# Altium schematic sheet 2014.10.05_Remote_V14.3.SchDoc
size A3
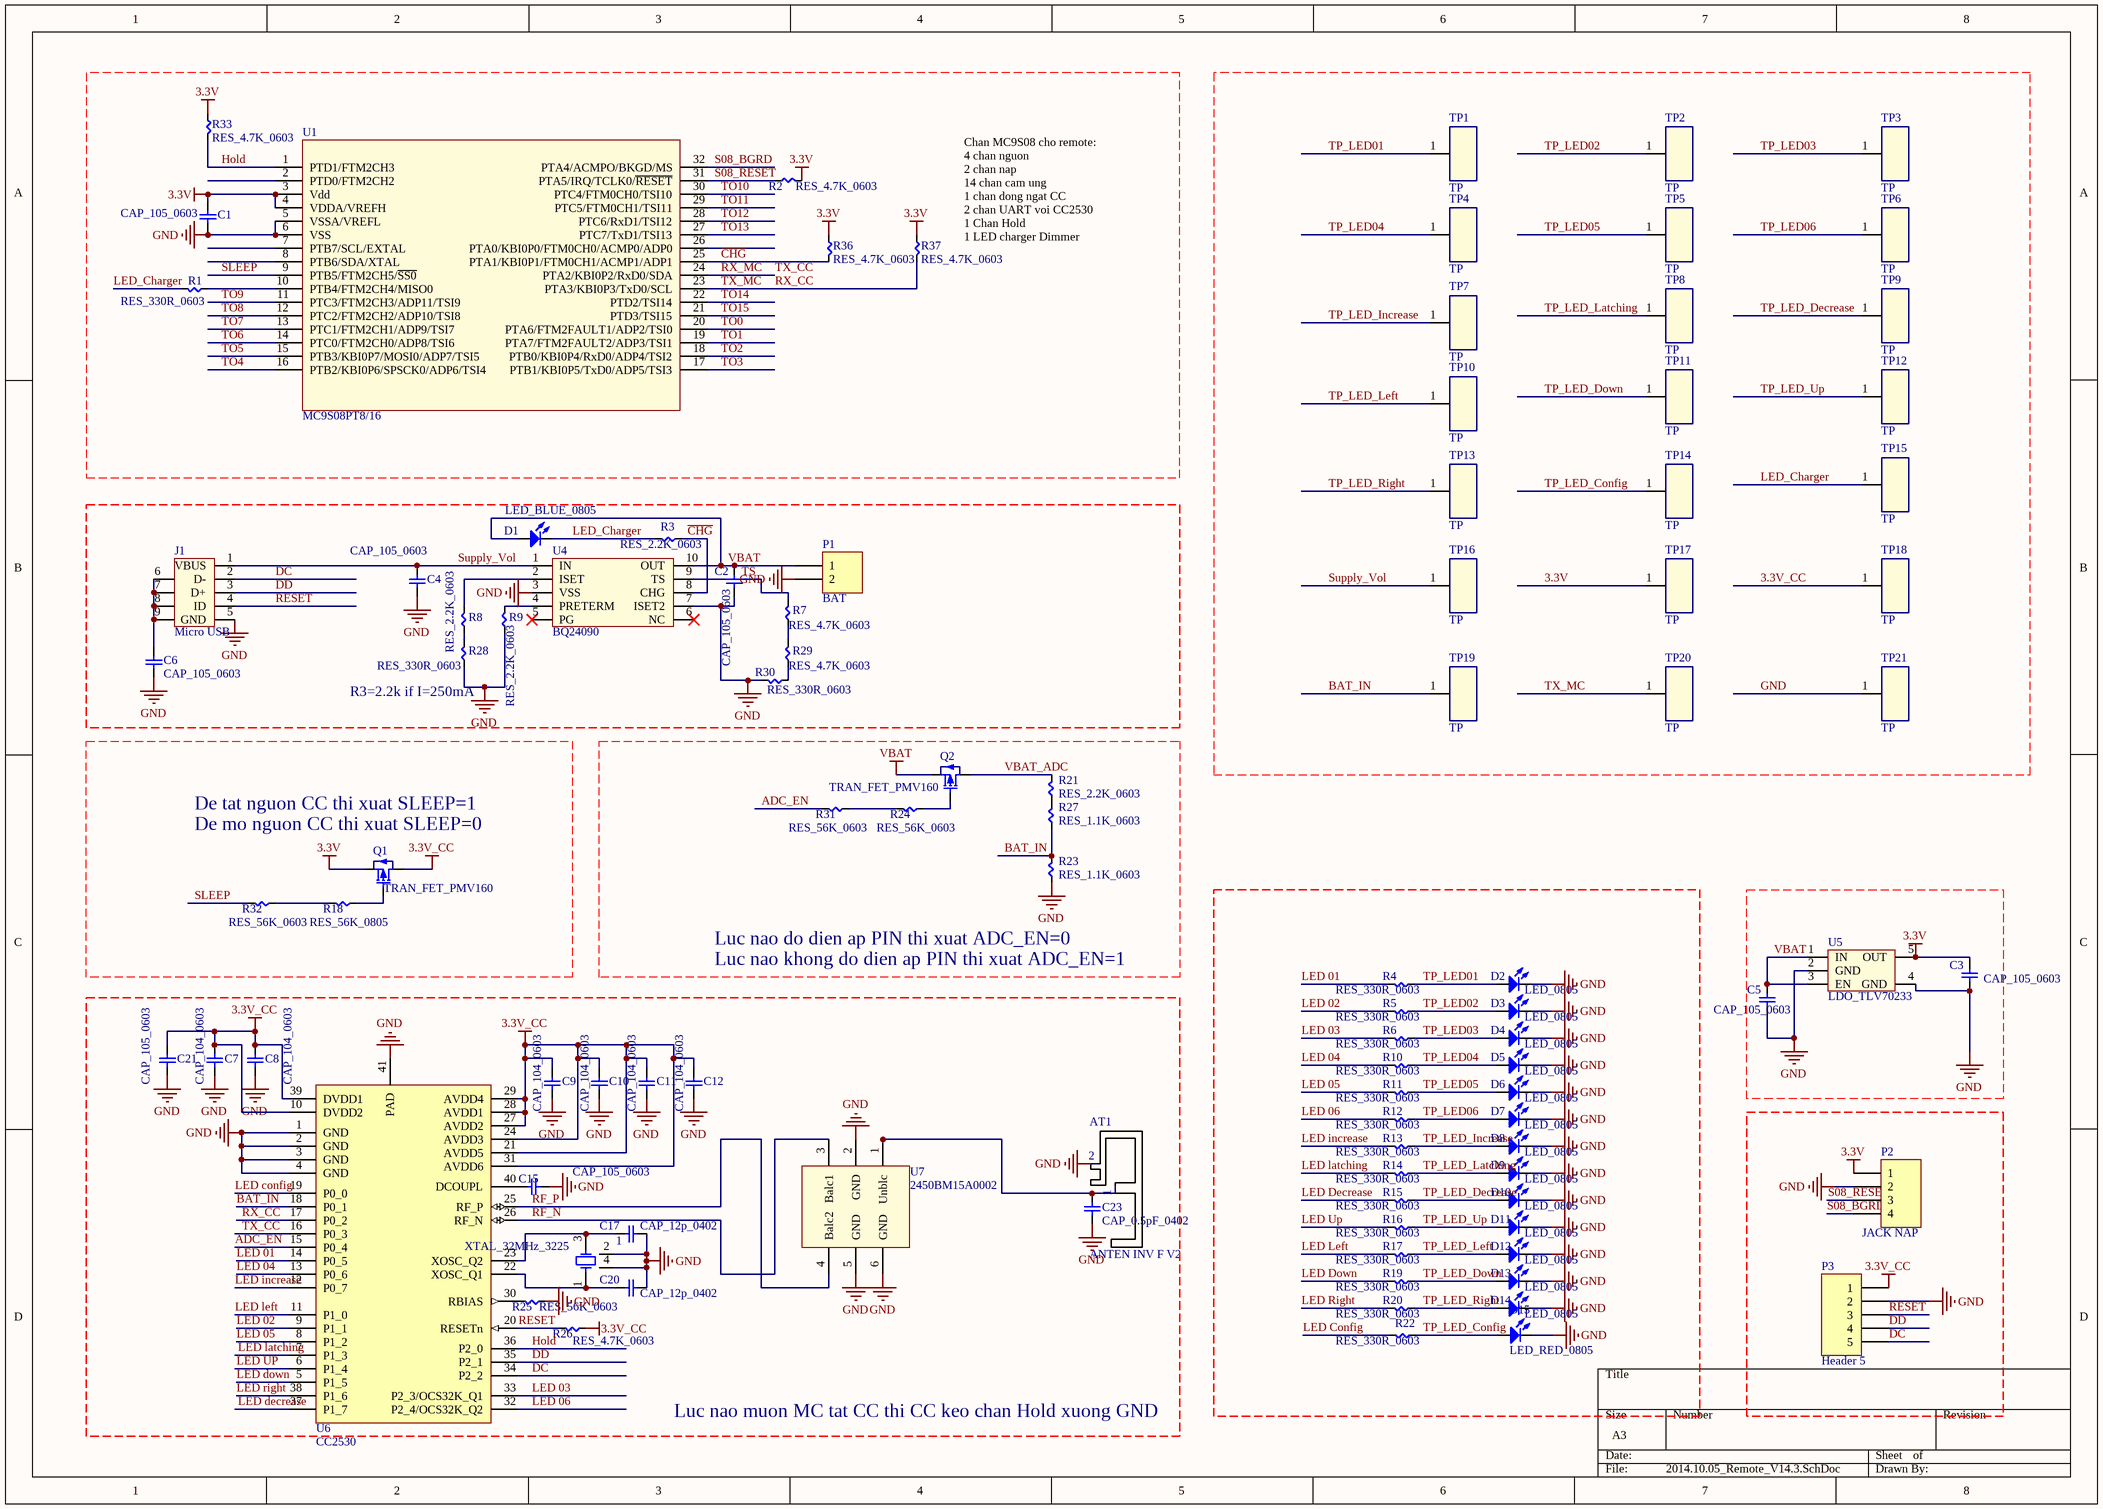
[diagram p0: 2014.10.05_Remote_V14.3.SchDoc]

## Parts
1  XTAL_32MHz_3225  [CRYSTAL_SMD_3225]
AT1  ANTEN INV F V2  [ANTEN_INVERTF_TI_2]
C1  CAP_105_0603  [CAP_0603_TOP]
C2  CAP_105_0603  [CAP_0603_TOP]
C3  CAP_105_0603  [CAP_0603_TOP]
C4  CAP_105_0603  [CAP_0603_TOP]
C5  CAP_105_0603  [CAP_0603_TOP]
C6  CAP_105_0603  [CAP_0603_TOP]
C7  CAP_104_0603  [CAP_0603_TOP]
C8  CAP_104_0603  [CAP_0603_TOP]
C9  CAP_104_0603  [CAP_0603_TOP]
C10  CAP_104_0603  [CAP_0603_TOP]
C11  CAP_104_0603  [CAP_0603_TOP]
C12  CAP_104_0603  [CAP_0603_TOP]
C15  CAP_105_0603  [CAP_0603_TOP]
C17  CAP_12p_0402  [CAP_0402_TOP]
C20  CAP_12p_0402  [CAP_0402_TOP]
C21  CAP_105_0603  [CAP_0603_TOP]
C23  CAP_0.5pF_0402  [CAP_0402_TOP]
D1  LED_BLUE_0805  [LED_0805_Reverse_2]
D2  LED_0805  [LED_0805_Reverse_2]
D3  LED_0805  [LED_0805_Reverse_2]
D4  LED_0805  [LED_0805_Reverse_2]
D5  LED_0805  [LED_0805_Reverse_2]
D6  LED_0805  [LED_0805_Reverse_2]
D7  LED_0805  [LED_0805_Reverse_2]
D8  LED_0805  [LED_0805_Reverse_2]
D9  LED_0805  [LED_0805_Reverse_2]
D10  LED_0805  [LED_0805_Reverse_2]
D11  LED_0805  [LED_0805_Reverse_2]
D12  LED_0805  [LED_0805_Reverse_2]
D13  LED_0805  [LED_0805_Reverse_2]
D14  LED_0805  [LED_0805_Reverse_2]
D15  LED_RED_0805  [LED_0805_Reverse_2]
J1  Micro USB  [CONNECTOR_MicroUSB2]
P1  BAT  [HDR1X2]
P2  JACK NAP  [HDR1X4]
P3  Header 5  [HDR1X5]
Q1  TRAN_FET_PMV160  [SOT_23_TO_236AB]
Q2  TRAN_FET_PMV160  [SOT_23_TO_236AB]
R1  RES_330R_0603  [Res_0603_TOP]
R2  RES_4.7K_0603  [Res_0603_TOP]
R3  RES_2.2K_0603  [Res_0603_TOP]
R4  RES_330R_0603  [Res_0603_TOP]
R5  RES_330R_0603  [Res_0603_TOP]
R6  RES_330R_0603  [Res_0603_TOP]
R7  RES_4.7K_0603  [Res_0603_TOP]
R8  RES_2.2K_0603  [RES_0603_TOP]
R9  RES_2.2K_0603  [Res_0603_TOP]
R10  RES_330R_0603  [Res_0603_TOP]
R11  RES_330R_0603  [Res_0603_TOP]
R12  RES_330R_0603  [Res_0603_TOP]
R13  RES_330R_0603  [Res_0603_TOP]
R14  RES_330R_0603  [Res_0603_TOP]
R15  RES_330R_0603  [Res_0603_TOP]
R16  RES_330R_0603  [Res_0603_TOP]
R17  RES_330R_0603  [Res_0603_TOP]
R18  RES_56K_0805  [Res_0603_TOP]
R19  RES_330R_0603  [Res_0603_TOP]
R20  RES_330R_0603  [Res_0603_TOP]
R21  RES_2.2K_0603  [Res_0603_TOP]
R22  RES_330R_0603  [Res_0603_TOP]
R23  RES_1.1K_0603  [Res_0603_TOP]
R24  RES_56K_0603  [Res_0603_TOP]
R25  RES_56K_0603  [Res_0603_TOP]
R26  RES_4.7K_0603  [Res_0603_TOP]
R27  RES_1.1K_0603  [Res_0603_TOP]
R28  RES_330R_0603  [RES_0603_TOP]
R29  RES_4.7K_0603  [Res_0603_TOP]
R30  RES_330R_0603  [Res_0603_TOP]
R31  RES_56K_0603  [Res_0603_TOP]
R32  RES_56K_0603  [Res_0603_TOP]
R33  RES_4.7K_0603  [Res_0603_TOP]
R36  RES_4.7K_0603  [Res_0603_TOP]
R37  RES_4.7K_0603  [Res_0603_TOP]
TP1  TP  [TEST_POINT_1]
TP2  TP  [TEST_POINT_1]
TP3  TP  [TEST_POINT_1]
TP4  TP  [TEST_POINT_1]
TP5  TP  [TEST_POINT_1]
TP6  TP  [TEST_POINT_1]
TP7  TP  [TEST_POINT_1]
TP8  TP  [TEST_POINT_1]
TP9  TP  [TEST_POINT_1]
TP10  TP  [TEST_POINT_1]
TP11  TP  [TEST_POINT_1]
TP12  TP  [TEST_POINT_1]
TP13  TP  [TEST_POINT_1]
TP14  TP  [TEST_POINT_1]
TP15  TP  [TEST_POINT_1]
TP16  TP  [TEST_POINT_1]
TP17  TP  [TEST_POINT_1]
TP18  TP  [TEST_POINT_1]
TP19  TP  [TEST_POINT_1]
TP20  TP  [TEST_POINT_1]
TP21  TP  [TEST_POINT_1]
U1  MC9S08PT8/16  [LQFP32]
U4  BQ24090  [MSOP_PowerPAD_DGQ]
U5  LDO_TLV70233  [SOT_235]
U6  CC2530  [VQFN_RHA_40PINS]
U7  2450BM15A0002  [BALUN_2450BM15A0002]

## Nets
3.3V: C1.2 C3.2 P2.1 Q1.2(S) R2.1 R33.2 R36.2 R37.2 TP17.1 U1.3(Vdd) U1.4(VDDA/VREFH) U5.5(OUT)
3.3V_CC: C7.1 C8.1 C9.1 C10.1 C11.1 C12.1 C21.1 P3.1 Q1.3(D) R26.2 TP18.1 U6.10(DVDD2) U6.21(AVDD5) U6.24(AVDD3) U6.27(AVDD2) U6.28(AVDD1) U6.29(AVDD4) U6.31(AVDD6) U6.39(DVDD1)
GND: 1.2 1.4 AT1.2 C1.1 C2.1 C3.1 C4.1 C5.1 C6.1 C7.2 C8.2 C9.2 C10.2 C11.2 C12.2 C15.2 C17.2 C20.2 C21.2 C23.1 D2.2(K) D3.2(K) D4.2(K) D5.2(K) D6.2(K) D7.2(K) D8.2(K) D9.2(K) D10.2(K) D11.2(K) D12.2(K) D13.2(K) D14.2(K) D15.2(K) J1.5(GND) P1.2 P2.2 P3.2 R9.2 R23.2 R25.2 R28.2 R30.1 TP21.1 U1.5(VSSA/VREFL) U1.6(VSS) U4.3(VSS) U4.7(ISET2) U5.2(GND) U5.4(GND) U6.1(GND) U6.2(GND) U6.3(GND) U6.4(GND) U6.41(PAD) U7.2(GND) U7.5(GND) U7.6(GND)
VBAT: C2.2 C5.2 D1.1(A) P1.1 Q2.2(S) U4.10(OUT) U5.1(IN) U5.3(EN)
ADC_EN: R31.1 U6.15(P0_4)
BAT_IN: R23.1 R27.2 TP19.1 U6.18(P0_1)
~{CHG}: R3.2 R36.1 U1.25(PTA1/KBI0P1/FTM0CH1/ACMP1/ADP1) U4.8(CHG)
DC: J1.2(D-) P3.5 U6.34(P2_2)
DD: J1.3(D+) P3.4 U6.35(P2_1)
Hold: R33.1 U1.1(PTD1/FTM2CH3) U6.36(P2_0)
LED 01: R4.1 U6.14(P0_5)
LED 02: R5.1 U6.9(P1_1)
LED 03: R6.1 U6.33(P2_3/OCS32K_Q1)
LED 04: R10.1 U6.13(P0_6)
LED 05: R11.1 U6.8(P1_2)
LED 06: R12.1 U6.32(P2_4/OCS32K_Q2)
LED Config: R22.1 U6.19(P0_0)
LED Decrease: R15.1 U6.37(P1_7)
LED Down: R19.1 U6.5(P1_5)
LED increase: R13.1 U6.12(P0_7)
LED latching: R14.1 U6.7(P1_3)
LED Left: R17.1 U6.11(P1_0)
LED Right: R20.1 U6.38(P1_6)
LED Up: R16.1 U6.6(P1_4)
LED_Charger: D1.2(K) R1.1 R3.1 TP15.1
RESET: J1.4(ID) P3.3 R26.1 U6.20(RESETn)
RF_N: U6.26(RF_N) U7.3(Balc1)
RF_P: U6.25(RF_P) U7.4(Balc2)
RX_CC: R37.1 TP20.1 U1.23(PTA3/KBI0P3/TxD0/SCL) U6.17(P0_2)  [also labelled TX_MC]
RX_MC: U1.24(PTA2/KBI0P2/RxD0/SDA) U6.16(P0_3)  [also labelled TX_CC]
S08_BGRD: P2.4 U1.32(PTA4/ACMPO/BKGD/MS)
S08_RESET: P2.3 R2.2 U1.31(PTA5/IRQ/TCLK0/~{RESET})
SLEEP: R32.1 U1.9(PTB5/FTM2CH5/~{SS0})
Supply_Vol: C4.2 J1.1(VBUS) TP16.1 U4.1(IN)
TO0: U1.20(PTA6/FTM2FAULT1/ADP2/TSI0)
TO1: U1.19(PTA7/FTM2FAULT2/ADP3/TSI1)
TO2: U1.18(PTB0/KBI0P4/RxD0/ADP4/TSI2)
TO3: U1.17(PTB1/KBI0P5/TxD0/ADP5/TSI3)
TO4: U1.16(PTB2/KBI0P6/SPSCK0/ADP6/TSI4)
TO5: U1.15(PTB3/KBI0P7/MOSI0/ADP7/TSI5)
TO6: U1.14(PTC0/FTM2CH0/ADP8/TSI6)
TO7: U1.13(PTC1/FTM2CH1/ADP9/TSI7)
TO8: U1.12(PTC2/FTM2CH2/ADP10/TSI8)
TO9: U1.11(PTC3/FTM2CH3/ADP11/TSI9)
TO10: U1.30(PTC4/FTM0CH0/TSI10)
TO11: U1.29(PTC5/FTM0CH1/TSI11)
TO12: U1.28(PTC6/RxD1/TSI12)
TO13: U1.27(PTC7/TxD1/TSI13)
TO14: U1.22(PTD2/TSI14)
TO15: U1.21(PTD3/TSI15)
TP_LED01: D2.1(A) R4.2 TP1.1
TP_LED02: D3.1(A) R5.2 TP2.1
TP_LED03: D4.1(A) R6.2 TP3.1
TP_LED04: D5.1(A) R10.2 TP4.1
TP_LED05: D6.1(A) R11.2 TP5.1
TP_LED06: D7.1(A) R12.2 TP6.1
TP_LED_Config: D15.1(A) R22.2 TP14.1
TP_LED_Decrease: D10.1(A) R15.2 TP9.1
TP_LED_Down: D13.1(A) R19.2 TP11.1
TP_LED_Increase: D8.1(A) R13.2 TP7.1
TP_LED_Latching: D9.1(A) R14.2 TP8.1
TP_LED_Left: D12.1(A) R17.2 TP10.1
TP_LED_Right: D14.1(A) R20.2 TP13.1
TP_LED_Up: D11.1(A) R16.2 TP12.1
TS: R7.1 U4.9(TS)
VBAT_ADC: Q2.3(D) R21.1
Net1_1: 1.1(OSC1) C20.1 U6.22(XOSC_Q1)
Net1_3: 1.3(OSC2) C17.1 U6.23(XOSC_Q2)
NetAT1_1: AT1.1 C23.2 U7.1(Unblc)
NetC6_2: C6.2 J1.6 J1.7 J1.8 J1.9
NetC15_1: C15.1 U6.40(DCOUPL)
NetQ1_1: Q1.1(G) R18.2
NetQ2_1: Q2.1(G) R24.2
NetR1_2: R1.2 U1.10(PTB4/FTM2CH4/MISO0)
NetR7_2: R7.2 R29.1
NetR8_1: R8.1 U4.2(ISET)
NetR8_2: R8.2 R28.1
NetR9_1: R9.1 U4.4(PRETERM)
NetR18_1: R18.1 R32.2
NetR21_2: R21.2 R27.1
NetR24_1: R24.1 R31.2
NetR25_1: R25.1 U6.30(RBIAS)
NetR29_2: R29.2 R30.2

Not connected (* = marked no-connect by the designer): U1 2(PTD0/FTM2CH2) 7(PTB7/SCL/EXTAL) 8(PTB6/SDA/XTAL) 26(PTA0/KBI0P0/FTM0CH0/ACMP0/ADP0); U4 5(PG)* 6(NC)*

## Notes on the sheet
- (near R37) Chan MC9S08 cho remote:
  4 chan nguon
  2 chan nap
  14 chan cam ung
  1 chan dong ngat CC
  2 chan UART voi CC2530
  1 Chan Hold
  1 LED charger Dimmer
- (near R28) R3=2.2k if I=250mA
- De tat nguon CC thi xuat SLEEP=1
- (near Q1) De mo nguon CC thi xuat SLEEP=0
- (near R23) Luc nao do dien ap PIN thi xuat ADC_EN=0
- Luc nao khong do dien ap PIN thi xuat ADC_EN=1
- Luc nao muon MC tat CC thi CC keo chan Hold xuong GND

## Library data of the parts
1 = CRYSTAL 5032: Crystal Oscillator; Published: 8-Jun-2000; LatestRevisionDate: 17-Jul-2002; LatestRevisionNote: Re-released for DXP Platform.; PackageReference: R38; Publisher: Altium Limited
C1-C6 = Cap 1206 BUT: Capacitor; Value: 104; Published: 8-Jun-2000; LatestRevisionDate: 17-Jul-2002; LatestRevisionNote: Re-released for DXP Platform.; PackageReference: RAD-0.3; Publisher: Altium Limited
C7-C12 C21 = Cap 1206 BUT: Capacitor; Published: 8-Jun-2000; LatestRevisionDate: 17-Jul-2002; LatestRevisionNote: Re-released for DXP Platform.; PackageReference: RAD-0.3; Publisher: Altium Limited
  C7 C8: Value: CAP_104_0603
  C9-C12: Value: 104_0603
  C21: Value: CAP_105_0603
C15 = Cap 1206 BUT: Capacitor; Value: 105_0805; Published: 8-Jun-2000; LatestRevisionDate: 17-Jul-2002; LatestRevisionNote: Re-released for DXP Platform.; PackageReference: RAD-0.3; Publisher: Altium Limited
C17 C20 C23 = Cap 1206 BUT: Capacitor; Value: 12pF_0603; Published: 8-Jun-2000; LatestRevisionDate: 17-Jul-2002; LatestRevisionNote: Re-released for DXP Platform.; PackageReference: RAD-0.3; Publisher: Altium Limited
D1-D15 = LED 0805 TOP: Typical INFRARED GaAs LED; Published: 8-Jun-2000; LatestRevisionDate: 08-Jul-2005; LatestRevisionNote: Mech Layer 1 removed.; PackageReference: LED-0; Publisher: Altium Limited; PackageDescription: LED; 2 Leads
P1 = Header 2: Header, 2-Pin; LatestRevisionDate: 17-Jul-2002; LatestRevisionNote: Re-released for DXP Platform.; Publisher: Altium Limited
P2 = Header 4: Header, 4-Pin; LatestRevisionDate: 17-Jul-2002; LatestRevisionNote: Re-released for DXP Platform.; Publisher: Altium Limited
P3 = Header 5: Header, 5-Pin; LatestRevisionDate: 17-Jul-2002; LatestRevisionNote: Re-released for DXP Platform.; Publisher: Altium Limited
Q1 Q2 = PMV160
R1-R33 R36 R37 = RES 0805 BUT: Resistor
TP1-TP21 = TestPoint
U1 = MC9S08PT8
U4 = BQ2040
U5 = TPS782xx
U6 = CC2530: 2.4 GHz IEEE 802.15.4 RF Transceiver; Published: 29-May-2009; DatasheetVersion: Dec-2007; PackageVersion: Jul-2007; PackageReference: RHD28; Publisher: Altium Limited; PackageDescription: 28-Pin Plastic Quad Flat No-Lead 0.5 mm Pitch; Code_JEDEC: MO-220; ComponentLink1Description: Datasheet; ComponentLink1URL: http://focus.ti.com/lit/ds/symlink/cc2520.pdf
U7 = Balun_0433BM15A0001